# EAGLE design Adafruit 16x8 Monochrome LED Backpack (EAGLE 6.4)
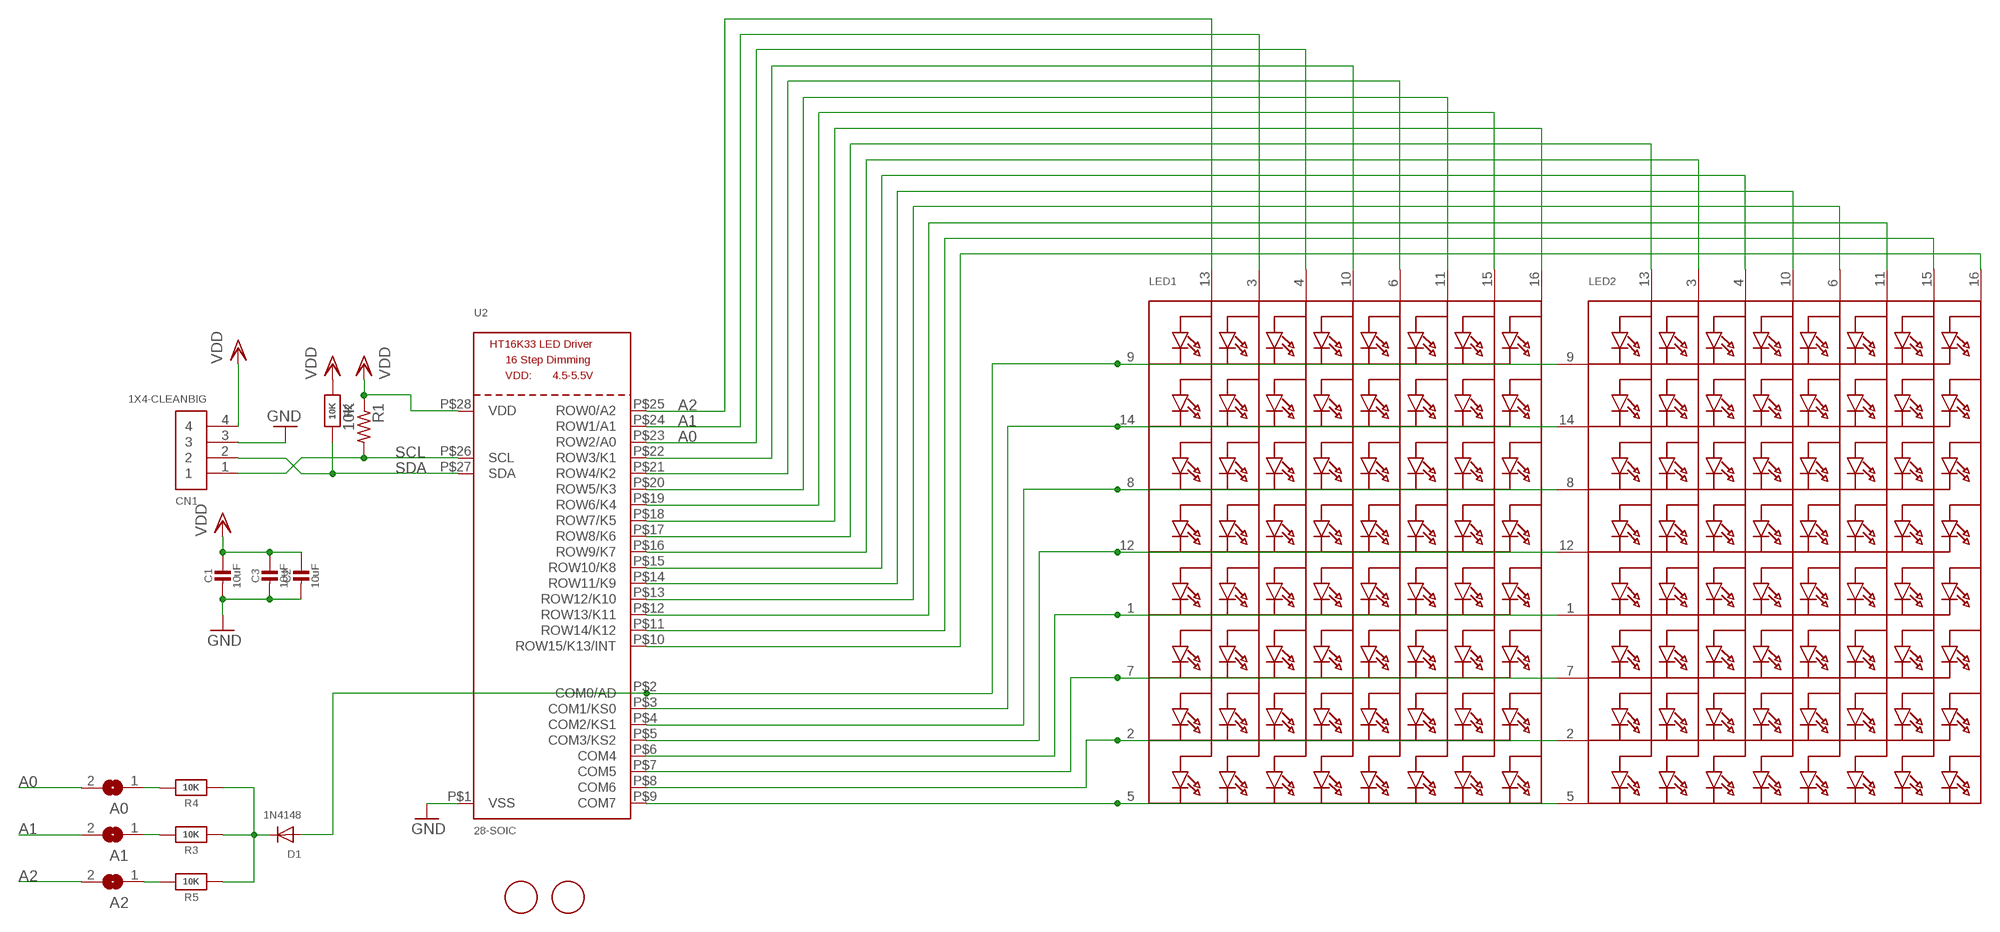
[diagram p0: schematic, sheet 1]

## Parts
A0  SOLDERJUMPERREFLOW_NOPASTE  [SOLDERJUMPER_REFLOW_NOPASTE]
A1  SOLDERJUMPERREFLOW_NOPASTE  [SOLDERJUMPER_REFLOW_NOPASTE]
A2  SOLDERJUMPERREFLOW_NOPASTE  [SOLDERJUMPER_REFLOW_NOPASTE]
C1  10uF  CAP_CERAMIC0805-NOOUTLINE  [0805-NO]
C2  10uF  CAP_CERAMIC0805-NOOUTLINE  [0805-NO]
C3  10uF  CAP_CERAMIC0805-NOOUTLINE  [0805-NO]
CN1  1X4-CLEANBIG  [1X04-CLEANBIG]
D1  1N4148  DIODESOD-323F  [SOD-323F]
LED1  DISP_SEGMENT_8X8_ROWCATHODEM12A881UR  [SEGMENT_BL-M12A881UR]
LED2  DISP_SEGMENT_8X8_ROWCATHODEM12A881UR  [SEGMENT_BL-M12A881UR]
R1  10K  R-US_R0805  [R0805]
R2  10K  RESISTOR0805_NOOUTLINE  [0805-NO]
R3  10K  RESISTOR0805_NOOUTLINE  [0805-NO]
R4  10K  RESISTOR0805_NOOUTLINE  [0805-NO]
R5  10K  RESISTOR0805_NOOUTLINE  [0805-NO]
U2  28-SOIC  HT16K33_SOP28  [SOP28_300MIL]
U$1  FIDUCIAL  [FIDUCIAL_1MM]
U$2  FIDUCIAL  [FIDUCIAL_1MM]

## Nets
A0: A0.2 LED1.4(A3) U2.P$23(ROW2/A0)
A1: A1.2 LED1.3(A2) U2.P$24(ROW1/A1)
A2: A2.2 LED1.13(A1) U2.P$25(ROW0/A2)
GND: C1.2 C2.2 C3.2 CN1.3 U2.P$1(VSS)
N$1: LED1.5(K8) LED2.5(K8) U2.P$9(COM7)
N$2: LED1.2(K7) LED2.2(K7) U2.P$8(COM6)
N$3: LED1.7(K6) LED2.7(K6) U2.P$7(COM5)
N$4: LED1.1(K5) LED2.1(K5) U2.P$6(COM4)
N$5: LED1.12(K4) LED2.12(K4) U2.P$5(COM3/KS2)
N$6: LED1.8(K3) LED2.8(K3) U2.P$4(COM2/KS1)
N$7: LED1.14(K2) LED2.14(K2) U2.P$3(COM1/KS0)
N$8: D1.A LED1.9(K1) LED2.9(K1) U2.P$2(COM0/AD)
N$9: A2.1 R5.2
N$10: LED2.15(A7) U2.P$11(ROW14/K12)
N$11: LED2.11(A6) U2.P$12(ROW13/K11)
N$12: LED2.16(A8) U2.P$10(ROW15/K13/INT)
N$16: D1.C R3.1 R4.1 R5.1
N$19: A1.1 R3.2
N$20: A0.1 R4.2
N$22: LED1.16(A8) U2.P$18(ROW7/K5)
N$23: LED1.15(A7) U2.P$19(ROW6/K4)
N$25: LED1.6(A5) U2.P$21(ROW4/K2)
N$26: LED1.10(A4) U2.P$22(ROW3/K1)
N$35: LED1.11(A6) U2.P$20(ROW5/K3)
N$38: LED2.13(A1) U2.P$17(ROW8/K6)
N$39: LED2.3(A2) U2.P$16(ROW9/K7)
N$40: LED2.10(A4) U2.P$14(ROW11/K9)
N$41: LED2.4(A3) U2.P$15(ROW10/K8)
N$42: LED2.6(A5) U2.P$13(ROW12/K10)
SCL: CN1.1 R1.2 U2.P$26(SCL)
SDA: CN1.2 R2.2 U2.P$27(SDA)
VDD: C1.1 C2.1 C3.1 CN1.4 R1.1 R2.1 U2.P$28(VDD)

## Library data of the parts
A0 A1 A2 = microbuilder:SOLDERJUMPER: SMD Solder JUMPER Solder the two pads together to create a connection, or remove the solder to break it. REFLOW - Use this footprint for solder paste and reflow ovens. WAVE - Use this footprint for hand-soldering (larger pads). CLOSED - Has a trace between the two pads to ensure it is closed by default. The trace needs to be cut to disable the jumper, and can be closed again by creating a solder bridge between the two pads.
C1-C3 = microbuilder:CAP_CERAMIC: Ceramic Capacitors For new designs, use the packages preceded by an '_' character since they are more reliable: The following footprints should be used on most boards: _0402 - Standard footprint for regular board layouts _0603 - Standard footprint for regular board layouts _0805 - Standard footprint for regular board layouts _1206 - Standard footprint for regular board layouts For extremely tight-pitch boards where space is at a premium, the following 'micro-pitch' footprints can be used (smaller pads, no silkscreen outline, etc.): _0402MP - Micro-pitch footprint for very dense/compact boards _0603MP - Micro-pitch footprint for very dense/compact boards _0805MP - Micro-pitch footprint for very dense/compact boards _1206MP - Micro-pitch footprint for very dense/compact boards
CN1 = adafruit:1X4: 4-pin connector
D1 = adafruit:DIODE: Diode SMADIODE - SMA Surface Mount Package 20V 1A Schottky Diode Digikey: 641-1014-6-ND DO-1N4148 - Through Hole Small Current Diode SOD-123 20V 1 A (.5mV Vf) Schottky Diode - Digikey: MBRX120TPMSCT-ND SOD-323 10V 570mA (.38mV Vf, 3ns) Schottky Diode - Digikey: ZLLS410CT-ND SOD-523 30V 30mA Schottky Diode (RB751S-40TE61) - Digikey: RB751S-40TE61CT-ND SOT23-R/W - SOT23 Package (R = Solder Paste/Reflow Ovens, W = Hand-Soldering) BAT54Film 40V 300mA - Digikey: 497-7162-1-ND
LED1 LED2 = microbuilder:DISP_SEGMENT_8X8_ROWCATHODE: 8x8 LED Segment Displays: Row = Cathode 0.7" Red 8X8 Matrix, 1.9mm Round LEDs - BL-M07C881UR 1.2" Red 8x8 Matrix, 3.0mm Round LEDs - BL-M12A881UR 1.2" Red 8x8 Matrix, 3.0mm Square LEDs - BL-M12A883
R1 = adafruit:R-US_: RESISTOR, American symbol
R2-R5 = microbuilder:RESISTOR: Resistors For new designs, use the packages preceded by an '_' character since they are more reliable: The following footprints should be used on most boards: _0402 - Standard footprint for regular board layouts _0603 - Standard footprint for regular board layouts _0805 - Standard footprint for regular board layouts _1206 - Standard footprint for regular board layouts For extremely tight-pitch boards where space is at a premium, the following 'micro-pitch' footprints can be used (smaller pads, no silkscreen outline, etc.): _0402MP - Micro-pitch footprint for very dense/compact boards _0603MP - Micro-pitch footprint for very dense/compact boards _0805MP - Micro-pitch footprint for very dense/compact boards _1206MP - Micro-pitch footprint for very dense/compact boards
U2 = microbuilder:HT16K33_SOP28
U$1 U$2 = adafruit:FIDUCIAL: For use by pick and place machines to calibrate the vision/machine, 1mm By microbuilder.eu

## Board
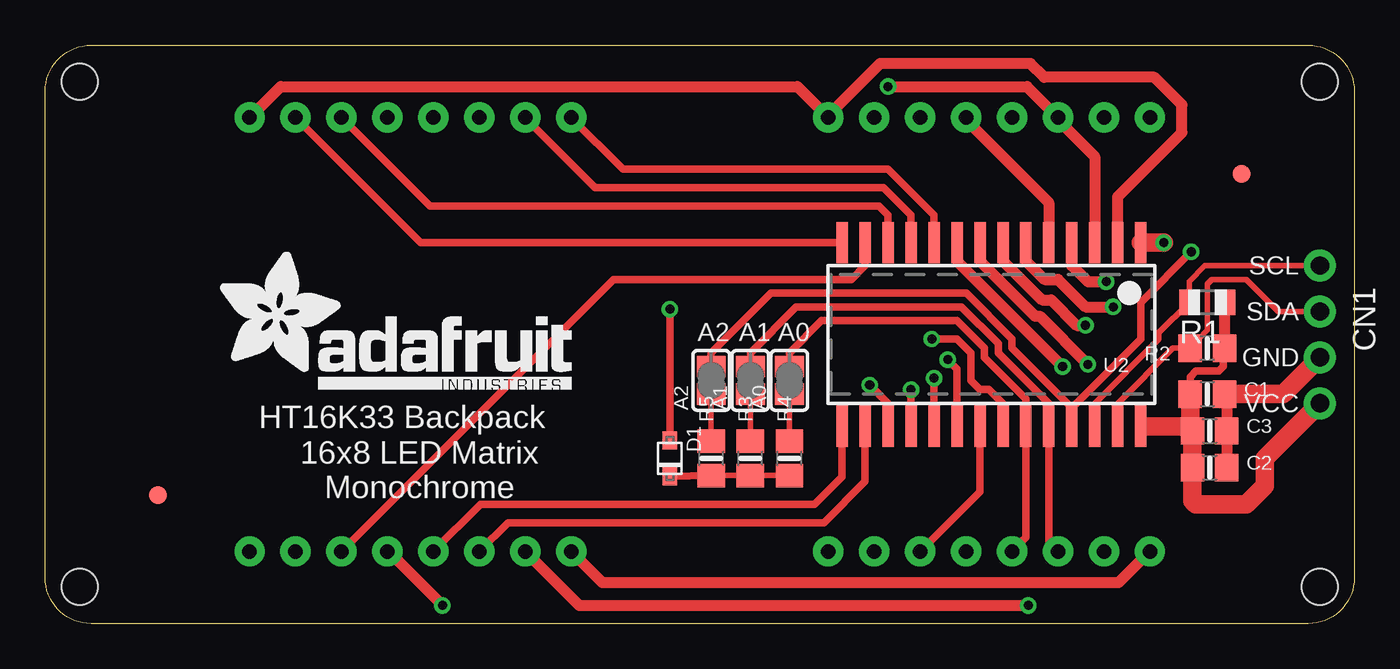
[diagram p1: board, top side]
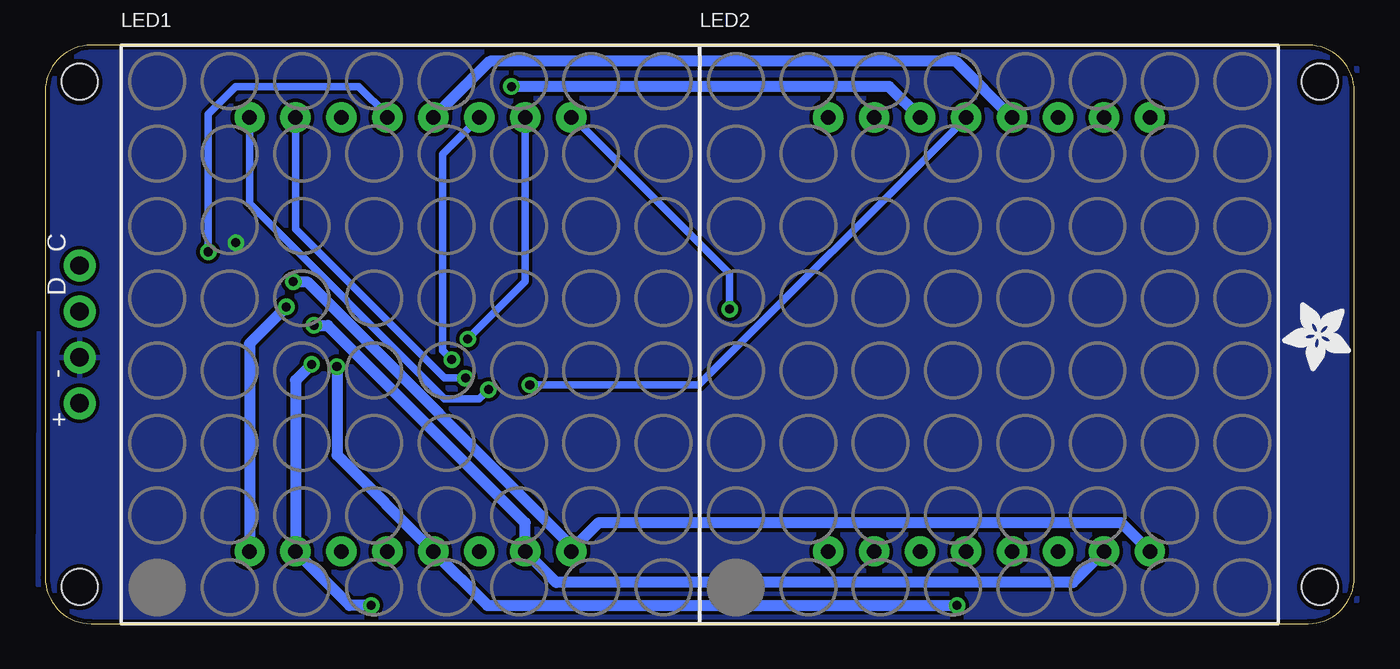
[diagram p2: board, bottom side, seen from below]

Size 72.39 x 32 mm. Coordinates in mm from the lower left corner, seen from the top.
Outline: 0,29.46 arc-90 2.54,32 69.85,32 arc-90 72.39,29.46 72.39,2.54 arc-90 69.85,0 2.54,0 arc-90 0,2.54 0,29.46
Copper layers (1*16): Top 0.035mm / dielectric 1.5mm / Bottom 0.035mm
Design rules "adafruit *": minimum track width 8mil, minimum drill 15.5mil, track to track 8mil, track to pad 8mil, pad to pad 8mil, via to via 8mil, smd to smd 8mil, copper to edge 10mil, drill to drill 8mil, minimum pad ring 10mil, minimum via ring 8mil, stop-mask expansion 2mil, vias tented up to drill 20mil, thermal gap 10mil
Holes 2 mm at 1.91,2.03 70.48,2.03 1.91,29.97 70.48,29.97

### Footprints (pad centres in the part's own frame; a part is rotated, then mirrored left to right if it is on the bottom)
SOLDERJUMPER_REFLOW_NOPASTE = smd 1.168 x 1.6: 1 -0.762,0; 2 0.762,0
0805-NO = smd 1.3 x 1.5: 1 -0.95,0; 2 0.95,0
1X04-CLEANBIG = drill 1.016 pad 1.778: 1 -3.81,0; 2 -1.27,0; 3 1.27,0; 4 3.81,0
SOD-323F = smd 1 x 0.8: A -1,0; C 1,0
SEGMENT_BL-M12A881UR = drill 0.8 pad 1.676: 1 -8.89,-12; 2 -6.35,-12; 3 -3.81,-12; 4 -1.27,-12; 5 1.27,-12; 6 3.81,-12; 7 6.35,-12; 8 8.89,-12; 9 8.89,12; 10 6.35,12; 11 3.81,12; 12 1.27,12; 13 -1.27,12; 14 -3.81,12; 15 -6.35,12; 16 -8.89,12
R0805 = smd 1.1 x 1.4: 1 -1,0; 2 1,0
SOP28_300MIL = smd 0.635 x 2.286: P$1 -8.255,-5.08; P$2 -6.985,-5.08; P$3 -5.715,-5.08; P$4 -4.445,-5.08; P$5 -3.175,-5.08; P$6 -1.905,-5.08; P$7 -0.635,-5.08; P$8 0.635,-5.08; P$9 1.905,-5.08; P$10 3.175,-5.08; P$11 4.445,-5.08; P$12 5.715,-5.08; P$13 6.985,-5.08; P$14 8.255,-5.08; P$15 8.255,5.08; P$16 6.985,5.08; P$17 5.715,5.08; P$18 4.445,5.08; P$19 3.175,5.08; P$20 1.905,5.08; P$21 0.635,5.08; P$22 -0.635,5.08; P$23 -1.905,5.08; P$24 -3.175,5.08; P$25 -4.445,5.08; P$26 -5.715,5.08; P$27 -6.985,5.08; P$28 -8.255,5.08
FIDUCIAL_1MM = smd 1 x 1: 1 0,0

### Placement (x,y rotation side)
A0  41.15,13.46 90 top
A1  38.99,13.46 90 top
A2  36.83,13.46 90 top
C1  64.26,12.7 0 top
C2  64.39,8.64 0 top
C3  64.39,10.67 0 top
CN1  70.48,16 270 top
D1  34.54,9.14 270 top
LED1  52.2,16 0 bottom
LED2  20.19,16 0 bottom
R1  64.26,17.78 180 top
R2  64.26,15.24 180 top
R3  38.99,9.14 90 top
R4  41.15,9.14 90 top
R5  36.83,9.14 90 top
U2  52.32,16 180 top
U$1  66.17,24.89 0 top
U$2  6.22,7.11 0 top
U$3  [ADAFRUIT_TEXT_20MM]  9.52,12.95 0 top
U$4  [ADAFRUIT_3.5MM]  0.18,17.78 180 bottom

### Tracks (layer width: path | path; a pad name or v marks a point on that pad's centre or on a via)
A0
  Top 0.406: A0.2 41.15,14.99 42.93,16.76 50.42,16.76 51.94,15.24 51.94,14.73 54.23,12.45 U2.P$23 54.23,4.77 LED1.4
A1
  Top 0.406: A1.2 38.99,14.99 41.53,17.53 50.67,17.53 52.7,15.49 52.7,14.99 55.5,12.19 U2.P$24 55.5,4.51 LED1.3
A2  (via drill 0.5)
  Top 0.406: 56.77,11.94 60.58,15.75 60.58,17.78 v63.37,20.57 | 56.77,11.94 U2.P$25 | 56.77,11.94 53.47,15.24 53.47,15.75 50.93,18.29 40.13,18.29 36.83,14.99 A2.2
  Bottom 0.406: v63.37,20.57 63.37,28.19 61.85,29.72 55.06,29.72 53.47,28.13 LED1.13
GND  (via drill 0.5)
  Top 0.61: C1.2 65.34,12.57 C3.2 C2.2
  Top 1.016: U2.P$1 v61.85,21.08 | CN1.3 68.45,12.7 C1.2
  pour Bottom: 70.1,0 2.41,0 -0.13,1.27 -0.13,30.73 1.4,32 69.6,32 72.64,30.23 72.77,2.16
N$1  (via drill 0.5)
  Top 0.61: U2.P$9 50.42,20.07 v56.26,14.22 | v21.97,1.02 18.98,4 LED2.5
  Bottom 0.61: v21.97,1.02 47.94,1.02 LED1.5 56.26,9.34 v56.26,14.22
N$2  (via drill 0.5)
  Top 0.61: U2.P$8 51.69,20.07 54.74,17.02 54.99,17.02 v57.66,14.35 | v54.36,1.02 29.53,1.02 LED2.2
  Bottom 0.61: v54.36,1.02 55.56,1.02 LED1.2 58.55,13.46 v57.66,14.35
N$3  (via drill 0.5)
  Top 0.61: U2.P$7 52.96,20.07 55.12,17.91 55.63,17.91 57.02,16.51 v57.53,16.51
  Bottom 0.61: 45.78,4 LED1.7 | v57.53,16.51 56.77,16.51 45.84,5.59 LED1.7 | LED2.7 15.56,2.29 44.13,2.29 LED1.7
N$4  (via drill 0.5)
  Top 0.61: U2.P$6 54.23,20.07 55.25,19.05 56.01,19.05 57.53,17.53 v59.05,17.53 | LED2.1 30.8,2.29 59.37,2.29 LED1.1
  Bottom 0.61: v59.05,17.53 61.09,15.5 LED1.1
N$5
  Top 0.61: U2.P$5 55.5,23.3 50.92,27.88 LED1.12
  Bottom 0.61: LED1.12 47.81,31.11 22.04,31.11 LED2.12
N$6  (via drill 0.5)
  Top 0.61: U2.P$4 56.77,19.81 57.66,18.92 v58.67,18.92
  Bottom 0.61: v58.67,18.92 57.91,18.92 43.3,4.32 LED1.8 43.3,4.07 41.78,5.59 12.89,5.59 LED2.8
N$7  (via drill 0.5)
  Top 0.61: U2.P$3 58.04,25.84 56,27.88 LED1.14 54.29,29.72 v46.61,29.72
  Bottom 0.61: v46.61,29.72 25.72,29.72 LED2.14
N$8  (via drill 0.5)
  Top 0.406: v34.54,17.4 D1.A
  Top 0.61: U2.P$2 59.31,23.62 62.87,27.18 62.87,28.7 61.34,30.23 55.25,30.23 54.48,30.99 46.17,30.99 43.3,28.13 LED1.9 41.59,29.72 13.02,29.72 LED2.9
  Bottom 0.406: v34.54,17.4 34.54,19.37 43.18,28 LED1.9
N$9
  Top 0.305: A2.1 R5.2
N$10
  Top 0.406: U2.P$11 47.88,22.61 46.36,24.13 30.42,24.13 LED2.15
N$11
  Top 0.406: U2.P$12 46.61,22.61 46.1,23.11 21.27,23.11 LED2.11
N$12
  Top 0.406: U2.P$10 49.15,22.61 46.61,25.15 31.94,25.15 LED2.16
N$16
  Top 0.305: R4.1 R3.1 R5.1
  Top 0.406: D1.C R5.1
N$19
  Top 0.305: A1.1 R3.2
N$20
  Top 0.305: A0.1 R4.2
N$22  (via drill 0.5)
  Top 0.406: U2.P$18 v47.88,12.95
  Bottom 0.406: v47.88,12.95 48.39,12.45 50.29,12.45 61.09,23.24 LED1.16
N$23  (via drill 0.5)
  Top 0.406: U2.P$19 v49.15,13.59
  Bottom 0.406: v49.15,13.59 50.29,13.59 58.55,21.84 LED1.15
N$25
  Top 0.406: LED1.6 51.69,7.31 U2.P$21
N$26  (via drill 0.5)
  Top 0.406: v49.02,15.75 50.42,15.75 51.18,14.99 51.18,13.46 51.69,12.95 52.2,12.95 52.96,12.19 U2.P$22
  Bottom 0.406: v49.02,15.75 45.84,18.92 LED1.10
N$35  (via drill 0.5)
  Top 0.406: v49.91,14.6 50.42,14.1 U2.P$20
  Bottom 0.406: v49.91,14.6 50.42,15.11 50.42,25.97 LED1.11
N$38  (via drill 0.5)
  Top 0.406: U2.P$17 46.61,12.19 v45.59,13.21
  Bottom 0.406: v45.59,13.21 36.26,13.21 LED2.13
N$39
  Top 0.406: U2.P$16 45.34,7.87 43.05,5.59 25.59,5.59 LED2.3
N$40
  Top 0.406: U2.P$14 20.77,21.08 LED2.10
N$41
  Top 0.406: U2.P$15 44.07,8.13 42.55,6.6 24.07,6.6 LED2.4
N$42
  Top 0.406: U2.P$13 45.34,19.81 44.58,19.05 31.43,19.05 LED2.6
SCL
  Top 0.305: U2.P$26 58.04,12.19 61.59,15.75 61.59,16.11 R1.2 63.26,18.94 64.14,19.81 CN1.1
SDA
  Top 0.305: CN1.2 68.2,17.27 66.42,19.05 64.52,19.05 64.26,18.8 64.26,16.24 R2.2 62.36,15.24 59.31,12.19 U2.P$27
VDD
  Top 0.406: 63.31,13.15 63.31,13.65 63.63,13.97 64.9,13.97 65.15,14.22 65.15,15.18 R2.1
  Top 0.61: C1.1 63.31,13.15 | 65.26,15.1 R2.1 R1.1 | 60.83,10.92 U2.P$28 | 63.19,10.92 63.31,10.92
  Top 1.016: C1.1 63.31,10.92 | CN1.4 67.44,9.14 67.44,7.62 66.42,6.6 63.63,6.6 63.44,6.79 C2.1 C3.1 63.19,10.92 60.83,10.92

### Text on the board
tPlace: SCL | SDA | A2 | A1 | A0 | GND | VCC | HT16K33 Backpack | 16x8 LED Matrix / Monochrome
bPlace: C | D | - | +